# Altium schematic sheet DTM12PIN.SchDoc
size A
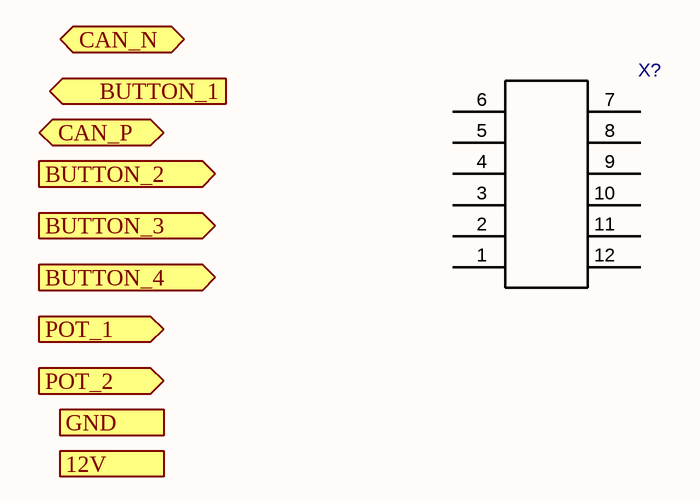
[diagram p0: DTM12PIN.SchDoc]

## Parts
X?  DTM15-12PA-G003  [DTM15-12PA-G003]  (value not drawn)

## Ports
12V, BUTTON_1 (out), BUTTON_2 (out), BUTTON_3 (out), BUTTON_4 (out), CAN_N (bidir), CAN_P (bidir), GND, POT_1 (out), POT_2 (out)

## Nets

Not connected (* = marked no-connect by the designer): X? 1 2 3 4 5 6 7 8 9 10 11 12

## Library data of the parts
X? = 30: 12 Pin DTM Board Connector; POSITIONS: 12; PITCH(MM): 0.157; ROWS/CONFIG: 2; Built_By: EMA_Justin; Vendor: TE Connectivity; id: 30; pitch: 4mm; Value: -; PRODUCT: -; TE Part Number: DTM15-12PA-G003; Manufacturer_Part_Number: DTM15-12PA-G003; Copyright: Copyright (C) 2016 Accelerated Designs. All rights reserved; Datasheet: https://www.te.com/commerce/DocumentDelivery/DDEController?Action=showdoc&DocId=Customer+Drawing%7FDTM15-12PX-G003%7F-%7Fpdf%7FEnglish%7FENG_CD_DTM15-12PX-G003_-.pdf%7FDTM15-12PA-G003; name: DTM15-12PA-G003; numcontacts: 12; numrows: 2; quantity: 0; package: DTM 12 Pin; link: https://www.te.com/usa-en/product-DTM15-12PA-G003.html; createdby: Kevin